# EAGLE design Simple_Boost_AAA_to_1V8 (EAGLE 7.2.0)
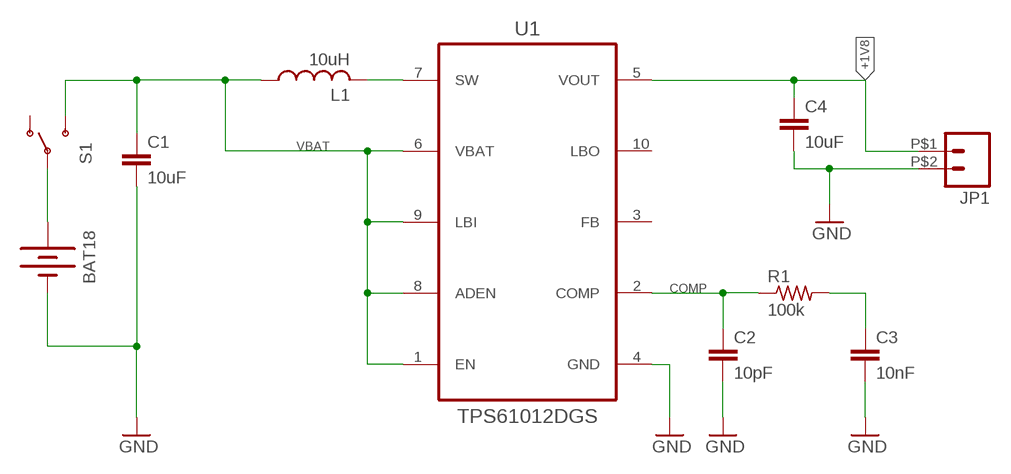
[diagram p0: schematic, sheet 1]

## Parts
BAT18  BATTERYAAA  [BATTERY-AAA]
C1  10uF  C-EUC1812  [C1812]
C2  10pF  C-EUC0805  [C0805]
C3  10nF  C-EUC0805  [C0805]
C4  10uF  C-EUC1812  [C1812]
JP1  M02TE-282834-2  [1X02_282834-2]
L1  10uH  SUMIDA_POWER_INDUCTOR6  [CDRH6D38]
R1  100k  R-US_R0805  [R0805]
S1  SWITCH-SPDTPTH  [SWITCH-SPDT]
U1  TPS61012DGS  [SOP50P490X110-10N]

## Nets
+1V8: C4.1 JP1.P$1 U1.5(VOUT)
COMP: C2.1 R1.1 U1.2(COMP)
GND: BAT18.GND@1(-) BAT18.GND@2(-) C1.2 C2.2 C3.2 C4.2 JP1.P$2 U1.4(GND)
N$1: C3.1 R1.2
N$2: BAT18.PWR@1(+) BAT18.PWR@2(+) S1.2(P)
SW: L1.P$2 U1.7(SW)
VBAT: C1.1 L1.P$1 S1.3(S) U1.1(EN) U1.6(VBAT) U1.8(ADEN) U1.9(LBI)
Unconnected: S1.1(O) U1.3(FB) U1.10(LBO)

## Library data of the parts
BAT18 = DensityAltitude:BATTERY: Battery Holders Various common sizes : AA, AAA, 18650 (PRT-12895), 20mm coin cell and 12mm coin cell. 20MM_4LEGS, BATT-10373; PROD_ID: BATT-08571
C1-C4 = rcl:C-EU: CAPACITOR, European symbol
JP1 = DensityAltitude:M02: Standard 2-pin 0.1" header. Use with - straight break away headers ( PRT-00116) - right angle break away headers (PRT-00553) - swiss pins (PRT-00743) - machine pins (PRT-00117) - female headers (PRT-00115) Molex polarized connector foot print use with: PRT-08233 with associated crimp pins and housings. 2.54_SCREWTERM for use with PRT-10571. 3.5mm Screw Terminal footprints for PRT-08084 5mm Screw Terminal footprints for use with PRT-08432
L1 = DensityAltitude:SUMIDA_POWER_INDUCTOR
R1 = rcl:R-US_: RESISTOR, American symbol
S1 = SparkFun-Electromechanical:SWITCH-SPDT: SPDT Switch Simple slide switch, Spark Fun Electronics SKU : COM-00102 DPDT SMT slide switch, AYZ0202, SWCH-08179; PROD_ID: SWCH-08261
U1 = DensityAltitude:TPS6101*: 1-CELL AND 2-CELL BOOST CONVERTERS; PACKAGE: MSOP-10; SUPPLIER: Texas Instruments; VOLTAGE: 1.8

## Net classes
1 big_power: width 1.93 mm

## Board
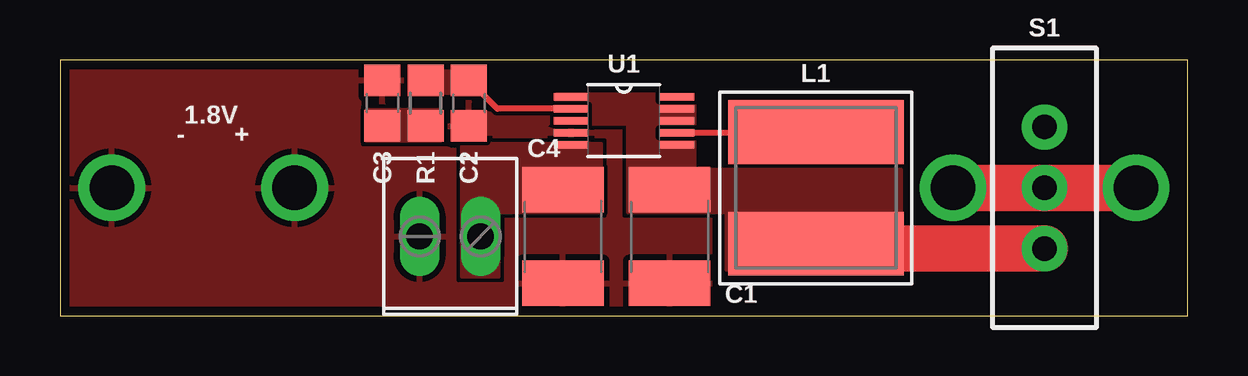
[diagram p1: board, top side]
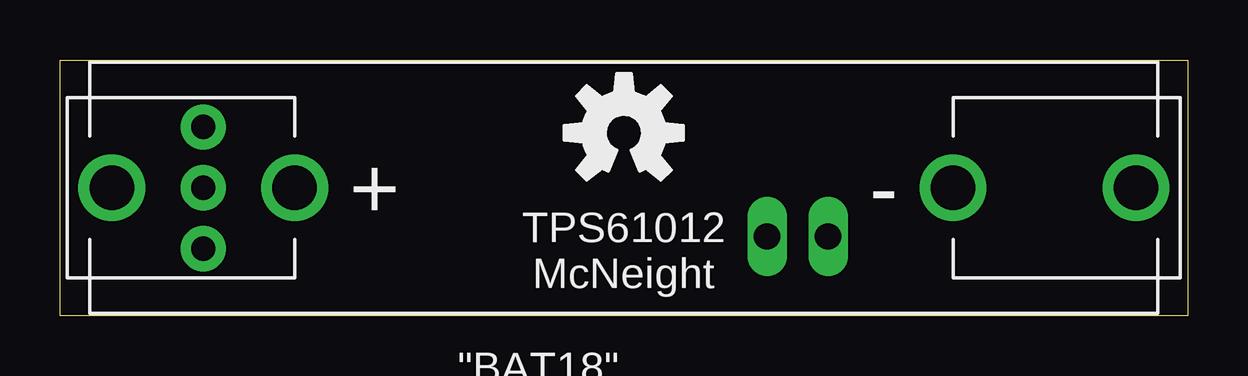
[diagram p2: board, bottom side, seen from below]

Size 46.99 x 10.67 mm. Coordinates in mm from the lower left corner, seen from the top.
Outline: 0,0 46.99,0 46.99,10.67 0,10.67 0,0
Copper layers (1*16): Top 0.0356mm / dielectric 1.5011mm / Bottom 0.0356mm
Design rules "oshpark-2layer": minimum track width 6mil, minimum drill 13mil, track to track 6mil, track to pad 6mil, pad to pad 6mil, via to via 6mil, smd to smd 6mil, copper to edge 15mil, drill to drill 6mil, minimum pad ring 7mil, minimum via ring 7mil, stop-mask expansion 4mil, vias tented up to drill 0mil, thermal gap 10mil

### Footprints (pad centres in the part's own frame; a part is rotated, then mirrored left to right if it is on the bottom)
BATTERY-AAA = drill 1.854: GND@1 21.336,0; GND@2 13.716,0; PWR@1 -21.336,0; PWR@2 -13.716,0
C1812 = smd 1.9 x 3.4: 1 -1.95,0; 2 1.95,0
C0805 = smd 1.3 x 1.5: 1 -0.95,0; 2 0.95,0
1X02_282834-2 = drill 1.1 long: P$1 -1.27,0; P$2 1.27,0
CDRH6D38 = smd 2.65 x 7.3: P$1 -2.325,0; P$2 2.325,0
R0805 = smd 1.3 x 1.5: 1 -0.95,0; 2 0.95,0
SWITCH-SPDT = drill 1.016 pad 1.88: 1 0,2.54; 2 0,0; 3 0,-2.54
SOP50P490X110-10N = smd 1.45 x 0.3: 1 -2.2,1; 2 -2.2,0.5; 3 -2.2,0; 4 -2.2,-0.5; 5 -2.2,-1; 6 2.2,-1; 7 2.2,-0.5; 8 2.2,0; 9 2.2,0.5; 10 2.2,1

### Placement (x,y rotation side)
BAT18  23.5,5.33 0 bottom
C1  25.4,3.3 270 top
C2  17.04,8.87 270 top
C3  13.44,8.87 90 top
C4  20.95,3.3 270 top
JP1  16.26,3.3 180 top
L1  31.5,5.33 90 top
R1  15.23,8.87 270 top
S1  41.02,5.33 0 top
U1  23.5,8.13 0 top
U$1  [OSHW-LOGO-M]  23.5,7.62 0 bottom

### Tracks (layer width: path | path; a pad name or v marks a point on that pad's centre or on a via)
+1V8
  pour Top (no thermals): 22.55,4.3 18.28,4.3 18.28,1.62 16.73,1.62 16.73,7.17 22.55,7.17
COMP
  Top 0.254: U1.2 18.22,8.63 C2.1
  pour Top (no thermals): 17.66,9.29 17.66,10.49 14.56,10.49 14.56,9.29
GND
  pour Top (rank 2): 0,0 0,10.67 27.05,10.67 27.05,0
  pour Top (no thermals): 16.38,8.51 16.38,7.57 23.08,7.57 23.08,7.62 21.08,7.62 17.65,8.51
N$1
  pour Top (no thermals): 15.86,7.29 15.86,8.59 12.76,8.59 12.76,7.29
N$2
  Top 1.93: BAT18.PWR@2 S1.2 BAT18.PWR@1
SW
  Top 0.254: U1.7 31.32,7.63 L1.P$2
VBAT
  Top 1.93: S1.3 31.57,2.79 L1.P$1
  pour Top (no thermals): 35.05,6.1 26.46,6.1 26.46,9.25 20.68,9.25 20.68,8 23.65,8 23.65,4.3 27.75,4.3 27.75,1.9 35.05,1.9

### Text on the board
tPlace: 1.8V | - | +
bPlace: TPS61012 / McNeight | "BAT18" / 1.5V AA > +1.8V